# Altium schematic sheet HBridge.SchDoc: Small H Bridge Driver
size A4; Author: Mark Harris; CompanyName: Original Circuit Limited; DrawnBy: Mark Harris; Engineer: Mark Harris; Organization: Original Circuit Limited; DocumentNumber: SHB-001; Revision: 0; SheetNumber: 1; SheetTotal: 1
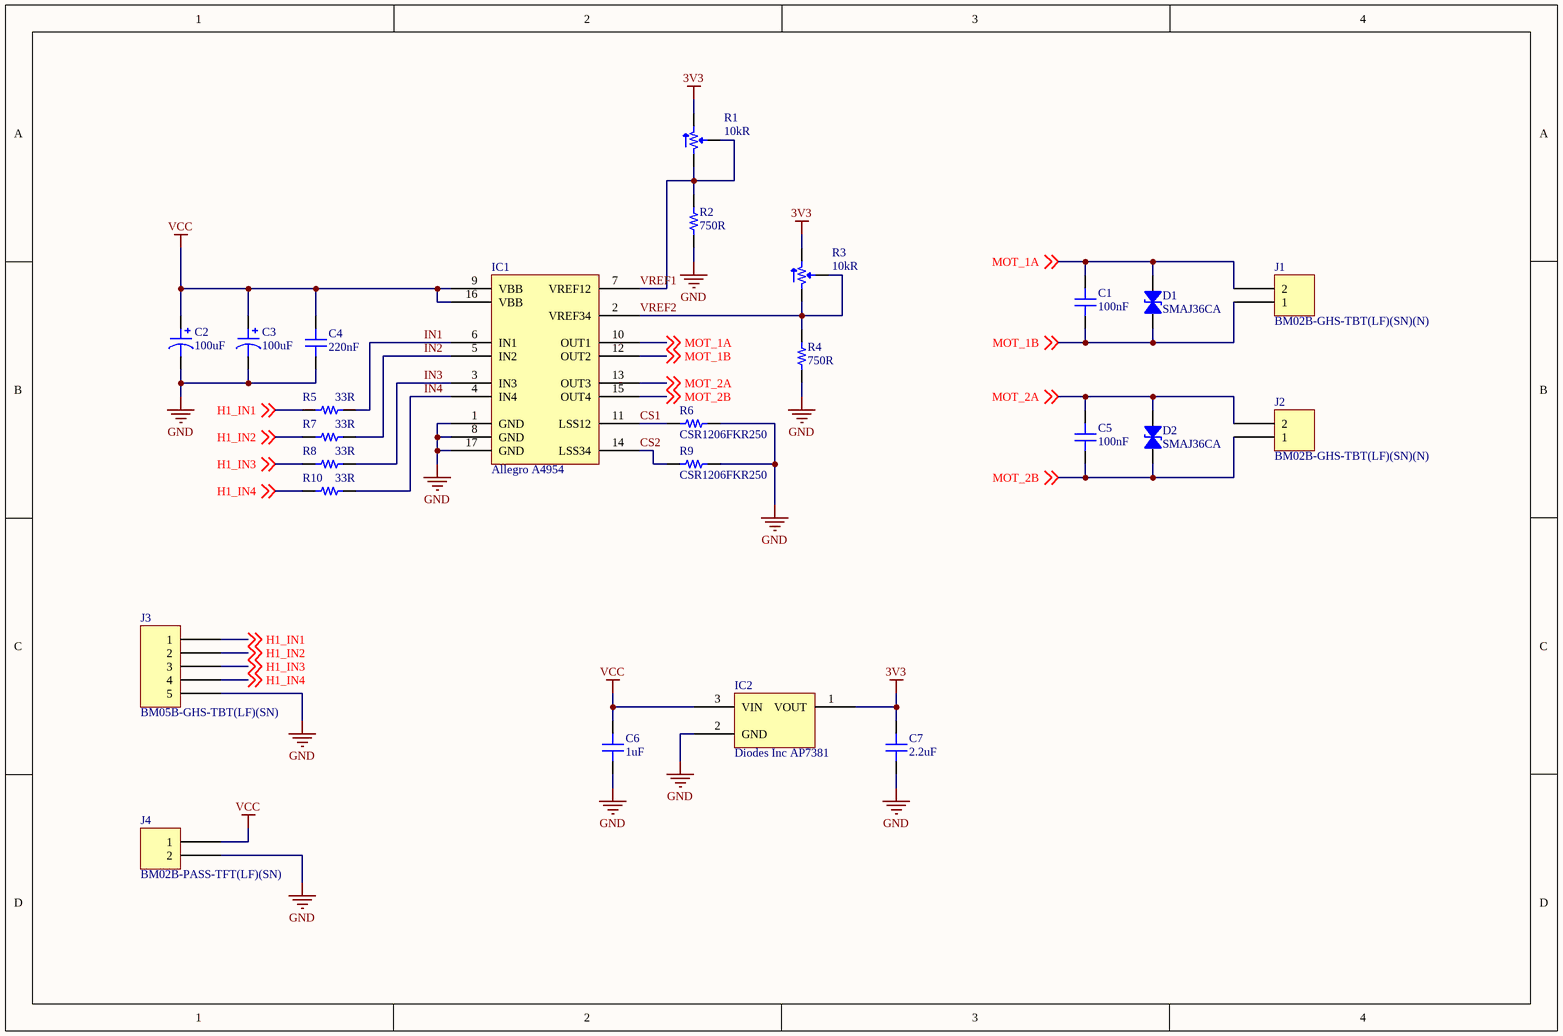
[diagram p0: HBridge.SchDoc]

## Parts
C1  100nF  [CAP 0402/1005]
C2  100uF  [CAP ALUM 8.3MM]
C3  100uF  [CAP ALUM 8.3MM]
C4  220nF  [CAP 0402/1005]
C5  100nF  [CAP 0402/1005]
C6  1uF  [CAP 0603/1608]
C7  2.2uF  [CAP 0603/1608]
D1  SMAJ36CA  [Bourns DO214AC SMA]
D2  SMAJ36CA  [Bourns DO214AC SMA]
IC1  Allegro A4954  [ALLEGRO TSSOP-16EP LP]
IC2  Diodes Inc AP7381  [DIODES INC SOT-89]
J1  BM02B-GHS-TBT(LF)(SN)(N)  [JST BM02B-GHS-TBT]
J2  BM02B-GHS-TBT(LF)(SN)(N)  [JST BM02B-GHS-TBT]
J3  BM05B-GHS-TBT(LF)(SN)  [JST BM05B-GHS-TBT]
J4  BM02B-PASS-TFT(LF)(SN)  [JST BM02B-GHS-TBT]
R1  10kR  [POT BOURNS TRIMPOT TC33X-1]
R2  750R  [RES 0402/1005]
R3  10kR  [POT BOURNS TRIMPOT TC33X-1]
R4  750R  [RES 0402/1005]
R5  33R  [RES 0402/1005]
R6  CSR1206FKR250  [STACKPOLE CSR1210]
R7  33R  [RES 0402/1005]
R8  33R  [RES 0402/1005]
R9  CSR1206FKR250  [STACKPOLE CSR1210]
R10  33R  [RES 0402/1005]

## Nets
3V3: C7.2 IC2.1(VOUT) R1.3 R3.3
GND: C2.2 C3.2 C4.2 C6.1 C7.1 IC1.1(GND) IC1.8(GND) IC1.17(GND) IC2.2(GND) J3.5 J4.2 R2.1 R4.1 R6.2 R9.2
VCC: C2.1 C3.1 C4.1 C6.2 IC1.9(VBB) IC1.16(VBB) IC2.3(VIN) J4.1
CS1: IC1.11(LSS12) R6.1
CS2: IC1.14(LSS34) R9.1
H1_IN1: J3.1 R5.1 ; off-sheet H1_IN1
H1_IN2: J3.2 R7.1 ; off-sheet H1_IN2
H1_IN3: J3.3 R8.1 ; off-sheet H1_IN3
H1_IN4: J3.4 R10.1 ; off-sheet H1_IN4
IN1: IC1.6(IN1) R5.2
IN2: IC1.5(IN2) R7.2
IN3: IC1.3(IN3) R8.2
IN4: IC1.4(IN4) R10.2
MOT_1A: C1.1 D1.2 IC1.10(OUT1) J1.2 ; off-sheet MOT_1A
MOT_1B: C1.2 D1.1 IC1.12(OUT2) J1.1 ; off-sheet MOT_1B
MOT_2A: C5.1 D2.2 IC1.13(OUT3) J2.2 ; off-sheet MOT_2A
MOT_2B: C5.2 D2.1 IC1.15(OUT4) J2.1 ; off-sheet MOT_2B
VREF1: IC1.7(VREF12) R1.1 R1.2 R2.2
VREF2: IC1.2(VREF34) R3.1 R3.2 R4.2

## Notes on the sheet
- Title
- Size:
- Date:
- A4
- Number:
- Time:
- Revision:
- Sheet
- of
- File:

## Library data of the parts
C1 C5 = Capacitor: SMT Capacitor; Manufacturer 1: Samsung; Manufacturer Part Number 1: CL05B104KO5NFNC; Tolerance: 10%; Voltage Rating: 16V; Dielectric: X7R; Supplier 1: Digi-Key; Supplier Part Number 1: 1276-1508-1-ND; Stock 1: 1111422; Pricing 1: 1=0.10000, 10=0.02400, 100=0.01060, 500=0.00760, 1000=0.00597, 2500=0.00542, 5000=0.00499 (USD); RoHS: Yes; Mount: Surface Mount; Case/Package: 0402; Case Code (Metric): 1005; Case Code (Imperial): 0402; Min Operating Temperature: -55°C; Max Operating Temperature: 125°C; Packaging: Tape and Reel; Package Quantity: 1; Capacitance: 100nF; Length: 1mm; Height: 0.5mm; Width: 0.02inch; Thickness: 0.022inch; Depth: 0.5mm; Radiation Hardening: No; ComponentLink1URL: https://datasheet.ciiva.com/25767/cl05b104ko5nfnc-25767124.pdf?src-supplier=Digi-Key; ComponentLink1Description: https://datasheet.ciiva.com/25767/cl05b104ko5nfnc-25767124.pdf?src-supplier=Digi-Key
C2 C3 = Polarised Capacitor: SMT Polarised Capacitor; Manufacturer 1: Nichicon; Manufacturer Part Number 1: UWT1H101MNL1GS; Dielectric Material: Aluminium; Tolerance: 20%; Ripple Current: 140mA; Voltage Rating: 50V; Leakage Current: 3uA; Life (Hours): 1000Hour; Dissipation Factor: 0.14%; Supplier 1: Digi-Key; Supplier Part Number 1: 493-2226-1-ND; Stock 1: 229777; Pricing 1: 1=0.48000, 10=0.34100, 100=0.22440 (USD); RoHS: Yes; Mount: Surface Mount; Case/Package: Radial; Number of Pins: 2; Min Operating Temperature: -55°C; Max Operating Temperature: 105°C; Capacitance: 100uF; Package Quantity: 500; Packaging: Tape and Reel; Ripple Current (AC): 140mA; Voltage Rating (DC): 50V; Termination: SMD/SMT; Voltage: 50V; Diameter: 8mm; Length: 10mm; Height: 10mm; Height - Seated (Max): 0.413inch; Radiation Hardening: No; REACH SVHC: No SVHC; Lead Free: Lead Free; ComponentLink1URL: https://datasheet.ciiva.com/97/e-wt-97104.pdf?src-supplier=Digi-Key; ComponentLink1Description: https://datasheet.ciiva.com/97/e-wt-97104.pdf?src-supplier=Digi-Key; ComponentLink2URL: https://datasheet.ciiva.com/97/e-wt-97105.pdf?src-supplier=Digi-Key; ComponentLink2Description: https://datasheet.ciiva.com/97/e-wt-97105.pdf?src-supplier=Digi-Key; ComponentLink3URL: https://datasheet.ciiva.com/97/e-wt-97106.pdf?src-supplier=Digi-Key; ComponentLink3Description: https://datasheet.ciiva.com/97/e-wt-97106.pdf?src-supplier=Digi-Key; ComponentLink4URL: https://datasheet.ciiva.com/11776/0900766b80fa3a91-11776930.pdf?src-supplier=RSComponents; ComponentLink4Description: https://datasheet.ciiva.com/11776/0900766b80fa3a91-11776930.pdf?src-supplier=RSComponents; ComponentLink5URL: https://datasheet.ciiva.com/5362/e-wt-30307-5362773.pdf?src-supplier=Mouser; ComponentLink5Description: https://datasheet.ciiva.com/5362/e-wt-30307-5362773.pdf?src-supplier=Mouser; ComponentLink6URL: https://datasheet.ciiva.com/11686/e-wt-11686889.pdf?src-supplier=Avnet; ComponentLink6Description: https://datasheet.ciiva.com/11686/e-wt-11686889.pdf?src-supplier=Avnet; ComponentLink7URL: https://datasheet.ciiva.com/28458/1910938-28458459.pdf?src-supplier=Element14; ComponentLink7Description: https://datasheet.ciiva.com/28458/1910938-28458459.pdf?src-supplier=Element14; ComponentLink8URL: https://datasheet.ciiva.com/16502/e-wt-16502940.pdf?src-supplier=Future+Electronics; ComponentLink8Description: https://datasheet.ciiva.com/16502/e-wt-16502940.pdf?src-supplier=Future+Electronics; ComponentLink9URL: https://datasheet.ciiva.com/7781/e-wt-7781807.pdf?src-supplier=Element14; ComponentLink9Description: https://datasheet.ciiva.com/7781/e-wt-7781807.pdf?src-supplier=Element14; ComponentLink10URL: https://datasheet.ciiva.com/17527/e-wt-17527183.pdf?src-supplier=Avnet+Europe; ComponentLink10Description: https://datasheet.ciiva.com/17527/e-wt-17527183.pdf?src-supplier=Avnet+Europe
C4 = Capacitor: SMT Capacitor; Manufacturer 1: Taiyo Yuden; Manufacturer Part Number 1: UMK105BJ224KV-F; Tolerance: 10%; Voltage Rating: 50V; Dielectric: X5R; Supplier 1: Digi-Key; Supplier Part Number 1: 587-3500-1-ND; Stock 1: 571795; Pricing 1: 1=0.21000, 10=0.14000, 100=0.07110, 500=0.04868, 1000=0.04306, 2500=0.04119, 5000=0.03744 (USD); RoHS: Yes; Mount: Surface Mount; Case/Package: 0402; Case Code (Metric): 1005; Case Code (Imperial): 0402; Min Operating Temperature: -55°C; Max Operating Temperature: 85°C; Package Quantity: 10000; Packaging: Tape and Reel; Capacitance: 220nF; Voltage Rating (DC): 50V; Termination: SMD/SMT; Length: 0.039inch; Height: 0.5mm; Width: 0.02inch; Thickness: 0.022inch; Lead Free: Lead Free; Halogen Free: Halogen Free; ComponentLink1URL: https://datasheet.ciiva.com/24495/460umk105bj224kv-f-24495779.pdf?src-supplier=Onlinecomponents.com; ComponentLink1Description: https://datasheet.ciiva.com/24495/460umk105bj224kv-f-24495779.pdf?src-supplier=Onlinecomponents.com; ComponentLink2URL: https://datasheet.ciiva.com/30112/713umk105bj224kv-f-30112478.pdf?src-supplier=Onlinecomponents.com; ComponentLink2Description: https://datasheet.ciiva.com/30112/713umk105bj224kv-f-30112478.pdf?src-supplier=Onlinecomponents.com; ComponentLink3URL: https://datasheet.ciiva.com/18697/mlcc-all-e-18697509.pdf?src-supplier=Digi-Key; ComponentLink3Description: https://datasheet.ciiva.com/18697/mlcc-all-e-18697509.pdf?src-supplier=Digi-Key
C6 = Capacitor: SMT Capacitor; Manufacturer 1: Samsung; Manufacturer Part Number 1: CL10A105KB8NNNC; Tolerance: 10%; Voltage Rating: 50V; Dielectric: X5R; Supplier 1: Digi-Key; Supplier Part Number 1: 1276-1860-1-ND; Stock 1: 1648884; Pricing 1: 1=0.17000, 10=0.12100, 100=0.05680, 500=0.03982, 1000=0.03297 (USD); RoHS: Yes; Mount: Surface Mount; Case/Package: 0603; Case Code (Metric): 1608; Case Code (Imperial): 0603; Contact Plating: Tin; Min Operating Temperature: -55°C; Max Operating Temperature: 85°C; Package Quantity: 1; Packaging: Tape and Reel; Capacitance: 1uF; Termination: Wraparound; Length: 1.6mm; Width: 0.031inch; Thickness: 0.035inch; Depth: 0.8mm; Radiation Hardening: No; ComponentLink1URL: https://datasheet.ciiva.com/26877/getdatasheetpartid-753736-26877879.pdf?src-supplier=Verical; ComponentLink1Description: https://datasheet.ciiva.com/26877/getdatasheetpartid-753736-26877879.pdf?src-supplier=Verical
C7 = Capacitor: SMT Capacitor; Manufacturer 1: Samsung; Manufacturer Part Number 1: CL10A225KP8NNNC; Material: Ceramic; Tolerance: 10%; Dielectric: X5R; Voltage Rating: 10V; Supplier 1: Digi-Key; Supplier Part Number 1: 1276-1085-1-ND; Stock 1: 239176; Pricing 1: 1=0.10000, 10=0.07600, 100=0.03400, 500=0.02426, 1000=0.01906 (USD); RoHS: Yes; Mount: Surface Mount; Case/Package: 0603; Case Code (Metric): 1608; Case Code (Imperial): 0603; Min Operating Temperature: -55°C; Max Operating Temperature: 85°C; Capacitance: 2.2uF; Package Quantity: 1; Packaging: Tape and Reel; Voltage: 10V; Voltage Rating (DC): 10V; Length: 1.6mm; Height: 0.8mm; Width: 0.031inch; Thickness: 0.035inch; Depth: 0.8mm; Radiation Hardening: No; Lead Free: Lead Free; ComponentLink1URL: https://datasheet.ciiva.com/25799/cl10a225kp8nnnc-25799697.pdf?src-supplier=Digi-Key; ComponentLink1Description: https://datasheet.ciiva.com/25799/cl10a225kp8nnnc-25799697.pdf?src-supplier=Digi-Key; ComponentLink2URL: https://datasheet.ciiva.com/26838/getdatasheetpartid-358617-26838359.pdf?src-supplier=Verical; ComponentLink2Description: https://datasheet.ciiva.com/26838/getdatasheetpartid-358617-26838359.pdf?src-supplier=Verical; ComponentLink3URL: https://datasheet.ciiva.com/29198/457945-da-01-en-vs-kondensator-0603-29198592.pdf?src-supplier=Conrad; ComponentLink3Description: https://datasheet.ciiva.com/29198/457945-da-01-en-vs-kondensator-0603-29198592.pdf?src-supplier=Conrad
D1 D2 = Diode Zener Bidirectional: Bidirectional Zener Diode; Manufacturer 1: Bourns; Operating Supply Voltage: 3.5V; Max Surge Current: 40A; Number of Elements: 1; Reverse Breakdown Voltage: 40V; Reverse Standoff Voltage: 36V; Clamping Voltage: 58.1V; Peak Pulse Power: 400W; Power Line Protection: No; Breakdown Voltage: 44.2V; Max Reverse Leakage Current: 5uA; Test Current: 1mA; ESD Protection: Yes; Peak Pulse Current: 6.9A; Element Configuration: Single; Supplier 1: Digi-Key; Supplier Part Number 1: SMAJ36CABCT-ND; Manufacturer Part Number 1: SMAJ36CA; Stock 1: 7267; Pricing 1: 1=0.47000, 10=0.35100, 25=0.31600, 100=0.21840, 250=0.18392, 500=0.14944, 1000=0.11496, 2500=0.10346 (USD); RoHS: Yes; Mount: Surface Mount; Case/Package: SMA; Number of Pins: 2; Min Operating Temperature: -55°C; Max Operating Temperature: 150°C; Package Quantity: 1; Direction: Bidirectional; Packaging: Tape and Reel; Number of Bidirectional Channels: 1; Min Breakdown Voltage: 40V; Number of Channels: 1; Polarity: Bidirectional; Termination: SMD/SMT; Max Breakdown Voltage: 44.2V; Max Power Dissipation: 400W; Leakage Current: 5uA; Composition: Zener; Length: 4.57mm; Height: 2.42mm; Width: 2.92mm; Radiation Hardening: No; REACH SVHC: No SVHC; ComponentLink1URL: https://datasheet.ciiva.com/25624/0900766b8112213b-25624856.pdf?src-supplier=RSComponents; ComponentLink1Description: https://datasheet.ciiva.com/25624/0900766b8112213b-25624856.pdf?src-supplier=RSComponents; ComponentLink2URL: https://datasheet.ciiva.com/17413/smaj-17413531.pdf?src-supplier=Avnet+Europe; ComponentLink2Description: https://datasheet.ciiva.com/17413/smaj-17413531.pdf?src-supplier=Avnet+Europe; ComponentLink3URL: https://datasheet.ciiva.com/8031/1695388-8031055.pdf?src-supplier=Element14; ComponentLink3Description: https://datasheet.ciiva.com/8031/1695388-8031055.pdf?src-supplier=Element14; ComponentLink4URL: https://datasheet.ciiva.com/334/smaj-334464.pdf?src-supplier=Digi-Key; ComponentLink4Description: https://datasheet.ciiva.com/334/smaj-334464.pdf?src-supplier=Digi-Key; ComponentLink5URL: https://datasheet.ciiva.com/3021/smaj-3021395.pdf?src-supplier=Avnet; ComponentLink5Description: https://datasheet.ciiva.com/3021/smaj-3021395.pdf?src-supplier=Avnet; ComponentLink6URL: https://datasheet.ciiva.com/3022/smaj-3022260.pdf?src-supplier=Avnet; ComponentLink6Description: https://datasheet.ciiva.com/3022/smaj-3022260.pdf?src-supplier=Avnet; ComponentLink7URL: https://datasheet.ciiva.com/8031/smaj-8031146.pdf?src-supplier=Element14; ComponentLink7Description: https://datasheet.ciiva.com/8031/smaj-8031146.pdf?src-supplier=Element14; ComponentLink8URL: https://datasheet.ciiva.com/8031/smaj-8031147.pdf?src-supplier=Element14; ComponentLink8Description: https://datasheet.ciiva.com/8031/smaj-8031147.pdf?src-supplier=Element14; ComponentLink9URL: https://datasheet.ciiva.com/334/smaj-334462.pdf?src-supplier=Digi-Key; ComponentLink9Description: https://datasheet.ciiva.com/334/smaj-334462.pdf?src-supplier=Digi-Key; ComponentLink10URL: https://datasheet.ciiva.com/334/smaj-334463.pdf?src-supplier=Digi-Key; ComponentLink10Description: https://datasheet.ciiva.com/334/smaj-334463.pdf?src-supplier=Digi-Key; ComponentLink11URL: https://datasheet.ciiva.com/16237/smaj-16237407.pdf?src-supplier=Onlinecomponents.com; ComponentLink11Description: https://datasheet.ciiva.com/16237/smaj-16237407.pdf?src-supplier=Onlinecomponents.com
IC1 = Allegro A4954: Manufacturer 1: Allegro MicroSystems; Manufacturer Part Number 1: A4954ELPTR-T; Min Supply Voltage: 8V; Max Supply Voltage: 40V; Number of Outputs: 2; Output Current: 1.5A; Supplier 1: Digi-Key; Supplier Part Number 1: 620-1384-1-ND; Stock 1: 59866; Pricing 1: 1=2.84000, 10=2.54900, 25=2.41040, 100=2.08880, 250=1.98172, 500=1.77820, 1000=1.49968 (USD); RoHS: Yes; Mount: Surface Mount; Case/Package: TSSOP; Min Operating Temperature: -40°C; Max Operating Temperature: 85°C; Packaging: Tape and Reel; Package Quantity: 1; Lead Free: Lead Free; ComponentLink1URL: https://datasheet.ciiva.com/8199/a4954-datasheet-8199653.pdf?src-supplier=Avnet; ComponentLink1Description: https://datasheet.ciiva.com/8199/a4954-datasheet-8199653.pdf?src-supplier=Avnet; ComponentLink2URL: https://datasheet.ciiva.com/17233/a4954-datasheet-17233770.pdf?src-supplier=Avnet+Europe; ComponentLink2Description: https://datasheet.ciiva.com/17233/a4954-datasheet-17233770.pdf?src-supplier=Avnet+Europe
IC2 = Diodes Inc AP7381: 150mA Low quiescent current fast transient low drop out linear regulator; Manufacturer Part Number 1: AP7381-33Y-13; Supplier 1: Digi-Key; Supplier Part Number 1: AP7381-33Y-13DICT-ND; Manufacturer 1: Diodes; Stock 1: 11928; Pricing 1: 1=0.44000, 10=0.32900, 100=0.20480, 500=0.14014, 1000=0.10780 (USD); RoHS: No; ComponentLink1URL: https://www.diodes.com/assets/Datasheets/AP7381.pdf?src-supplier=Digi-Key; ComponentLink1Description: https://www.diodes.com/assets/Datasheets/AP7381.pdf?src-supplier=Digi-Key
J1 J2 = 2 Pin: Manufacturer 1: JST; Number of Positions: 2; Connector Type: Outer Shroud Contact; Pitch: 0.049inch; Supplier 1: Digi-Key; Supplier Part Number 1: 455-1578-1-ND; Manufacturer Part Number 1: BM02B-GHS-TBT(LF)(SN)(N); Stock 1: 70745; Pricing 1: 1=0.43000, 10=0.40500, 100=0.28330, 500=0.24284, 1000=0.20236 (USD); RoHS: Yes; Mount: Surface Mount; Contact Plating: Tin; Color: Natural; Packaging: Tape and Reel; Number of Rows: 1; Termination: Solder; Fastening Type: Ramp; Lead Free: Lead Free; ComponentLink1URL: http://www.jst-mfg.com/product/pdf/eng/eGH.pdf?src-supplier=Digi-Key; ComponentLink1Description: http://www.jst-mfg.com/product/pdf/eng/eGH.pdf?src-supplier=Digi-Key
J3 = 5 Pin: Manufacturer 1: JST; Number of Positions: 5; Current Rating: 1A; Voltage Rating: 50V; Pitch: 1.25mm; Connector Type: Outer Shroud Contact; Supplier 1: RSComponents; Supplier Part Number 1: 7521778; Manufacturer Part Number 1: BM05B-GHS-TBT(LF)(SN); Stock 1: 460; Pricing 1: 5=0.45000, 125=0.32200, 500=0.28800, 2500=0.26800, 5000=0.25400 (GBP); RoHS: Yes; Case/Package: SMD/SMT; Contact Plating: Tin; Contact Material: Bronze; Housing Color: Natural; Housing Material: Nylon; Number of Rows: 1; Termination: Solder; Packaging: Cut Tape; Number of Contacts: 5; Orientation: Straight; Lead Free: Lead Free; REACH SVHC: No SVHC; ComponentLink1URL: https://datasheet.ciiva.com/25617/0900766b810cef17-25617254.pdf?src-supplier=RSComponents; ComponentLink1Description: https://datasheet.ciiva.com/25617/0900766b810cef17-25617254.pdf?src-supplier=RSComponents; ComponentLink2URL: https://datasheet.ciiva.com/16419/egh-16419225.pdf?src-supplier=Future+Electronics; ComponentLink2Description: https://datasheet.ciiva.com/16419/egh-16419225.pdf?src-supplier=Future+Electronics; Supplier 2: Digi-Key; Supplier Part Number 2: 455-1581-1-ND; Manufacturer 2: JST; Manufacturer Part Number 2: BM05B-GHS-TBT(LF)(SN)(N); Stock 2: 19737; Pricing 2: 1=0.46000, 10=0.43200, 100=0.33110, 500=0.28792, 1000=0.23753 (USD); Mount: Surface Mount; Number of Pins: 5; Color: Natural; Fastening Type: Ramp; ComponentLink3URL: http://www.jst-mfg.com/product/pdf/eng/eGH.pdf?src-supplier=Digi-Key; ComponentLink3Description: http://www.jst-mfg.com/product/pdf/eng/eGH.pdf?src-supplier=Digi-Key; ComponentLink4URL: http://www.jst-mfg.com/product/pdf/eng/eGH.pdf?src-supplier=Arrow; ComponentLink4Description: http://www.jst-mfg.com/product/pdf/eng/eGH.pdf?src-supplier=Arrow; ComponentLink5URL: http://www.jst-mfg.com/product/pdf/eng/eGH.pdf?src-supplier=Verical; ComponentLink5Description: http://www.jst-mfg.com/product/pdf/eng/eGH.pdf?src-supplier=Verical
J4 = 2 Pin: Manufacturer 1: JST; Number of Positions: 2; Gender: Male; Pitch: 2mm; Supplier 1: Future Electronics; Supplier Part Number 1: BM02B-PASS-TFT(LF)(SN)-CUTT; Manufacturer Part Number 1: BM02B-PASS-TFT(LF)(SN); Stock 1: 290894; Pricing 1: 1=0.90000, 25=0.70000, 50=0.66500, 100=0.63000, 250=0.58500 (USD); RoHS: Yes; Case/Package: SMD/SMT; Color: Beige; Contact Material: Copper; Termination: Crimp; Lead Free: Lead Free; ComponentLink1URL: http://www1.futureelectronics.com/doc/JST/BM02B-PASS-TFT(LF)(SN).pdf?src-supplier=Future+Electronics; ComponentLink1Description: http://www1.futureelectronics.com/doc/JST/BM02B-PASS-TFT(LF)(SN).pdf?src-supplier=Future+Electronics; ComponentLink2URL: http://www.jst-mfg.com/product/pdf/eng/ePA-F.pdf?src-supplier=Digi-Key; ComponentLink2Description: http://www.jst-mfg.com/product/pdf/eng/ePA-F.pdf?src-supplier=Digi-Key
R1 R3 = Potentiometer: Manufacturer 1: Bourns; Manufacturer Part Number 1: TC33X-1-103E; Tolerance: 25%; Power Rating: 100mW; Temperature Coefficient: 250ppm/°C; Supplier 1: Digi-Key; Supplier Part Number 1: TC33X-1-103ECT-ND; Stock 1: 60149; Pricing 1: 1=0.28000, 10=0.27700, 25=0.25040, 50=0.23880, 100=0.23100, 250=0.21560, 500=0.19636, 1000=0.17710 (USD); RoHS: Yes; Mount: Surface Mount; Min Operating Temperature: -40°C; Max Operating Temperature: 100°C; Resistance: 10kR; Package Quantity: 2500; Packaging: Tape and Reel; Termination: Foot Print; Military Standard: Not; Max Power Dissipation: 100mW; Composition: Cermet; Length: 3mm; Height: 0.047inch; Width: 0.118inch; Depth: 3.8mm; ComponentLink1URL: https://datasheet.ciiva.com/17562/tc33-17562453.pdf?src-supplier=Avnet+Europe; ComponentLink1Description: https://datasheet.ciiva.com/17562/tc33-17562453.pdf?src-supplier=Avnet+Europe; ComponentLink2URL: https://datasheet.ciiva.com/2159/tc33-2159804.pdf?src-supplier=Digi-Key; ComponentLink2Description: https://datasheet.ciiva.com/2159/tc33-2159804.pdf?src-supplier=Digi-Key
R2 R4 = Resistor: SMT Resistor; Manufacturer 1: Panasonic; Manufacturer Part Number 1: ERJ2RKF7500X; Power Rating: 100mW; Tolerance: 1%; Voltage Rating: 50V; Temperature Coefficient: 100ppm/°C; Supplier 1: Newark; Supplier Part Number 1: 63W0663; Stock 1: 0; RoHS: Yes; Mount: Surface Mount; Case/Package: 0402; Case Code (Metric): 1005; Case Code (Imperial): 0402; Contact Plating: Tin; Min Operating Temperature: -55°C; Max Operating Temperature: 155°C; Resistance: 750R; Packaging: Tape and Reel; Composition: Thick Film; Military Standard: Not; Voltage Rating (DC): 50V; Package Quantity: 10000; Number of Terminations: 2; Termination: SMD/SMT; Max Power Dissipation: 100mW; Features: Automotive AEC-Q200; Length: 1mm; Height: 0.35mm; Depth: 0.5mm; Width: 0.02inch; REACH SVHC: No SVHC; Lead Free: Lead Free; ComponentLink1URL: https://datasheet.ciiva.com/9180/aoa0000ce2-9180085.pdf?src-supplier=Avnet; ComponentLink1Description: https://datasheet.ciiva.com/9180/aoa0000ce2-9180085.pdf?src-supplier=Avnet; ComponentLink2URL: https://datasheet.ciiva.com/28676/1678782-28676646.pdf?src-supplier=Element14; ComponentLink2Description: https://datasheet.ciiva.com/28676/1678782-28676646.pdf?src-supplier=Element14; ComponentLink3URL: https://datasheet.ciiva.com/28565/1678782-28565079.pdf?src-supplier=Element14; ComponentLink3Description: https://datasheet.ciiva.com/28565/1678782-28565079.pdf?src-supplier=Element14; ComponentLink4URL: https://datasheet.ciiva.com/30202/aoa0000ce2-30202551.pdf?src-supplier=Onlinecomponents.com; ComponentLink4Description: https://datasheet.ciiva.com/30202/aoa0000ce2-30202551.pdf?src-supplier=Onlinecomponents.com
R5 R7 R8 R10 = Resistor: SMT Resistor; Manufacturer 1: Panasonic; Manufacturer Part Number 1: ERJ-2GEJ330X; Tolerance: 5%; Power Rating: 100mW; Voltage Rating: 50V; Temperature Coefficient: 200ppm/°C; Supplier 1: Digi-Key; Supplier Part Number 1: P33JCT-ND; Stock 1: 2284531; Pricing 1: 1=0.10000, 10=0.03100, 100=0.01250, 1000=0.00560, 2500=0.00486, 5000=0.00401 (USD); RoHS: Yes; Mount: Surface Mount; Case/Package: 0402; Case Code (Metric): 1005; Case Code (Imperial): 0402; Contact Plating: Tin; Min Operating Temperature: -55°C; Max Operating Temperature: 155°C; Resistance: 33R; Packaging: Tape and Reel; Composition: Thick Film; Package Quantity: 1; Number of Terminations: 2; Termination: SMD/SMT; Military Standard: Not; Max Power Dissipation: 100mW; Voltage Rating (DC): 50V; Features: Automotive AEC-Q200; Length: 1mm; Height: 0.35mm; Depth: 0.5mm; Width: 0.02inch; Radiation Hardening: No; REACH SVHC: No SVHC; Lead Free: Lead Free; ComponentLink1URL: https://datasheet.ciiva.com/11821/0900766b80f806dd-11821291.pdf?src-supplier=RSComponents; ComponentLink1Description: https://datasheet.ciiva.com/11821/0900766b80f806dd-11821291.pdf?src-supplier=RSComponents; ComponentLink2URL: https://datasheet.ciiva.com/39121/1986916-39121637.pdf?src-supplier=Jameco; ComponentLink2Description: https://datasheet.ciiva.com/39121/1986916-39121637.pdf?src-supplier=Jameco; ComponentLink3URL: https://datasheet.ciiva.com/43460/1500035-43460357.pdf?src-supplier=Farnell; ComponentLink3Description: https://datasheet.ciiva.com/43460/1500035-43460357.pdf?src-supplier=Farnell; ComponentLink4URL: https://datasheet.ciiva.com/46374/1500035-46374021.pdf?src-supplier=Element14; ComponentLink4Description: https://datasheet.ciiva.com/46374/1500035-46374021.pdf?src-supplier=Element14; ComponentLink5URL: https://datasheet.ciiva.com/16522/aoa0000ce1-16522983.pdf?src-supplier=Avnet+Asia; ComponentLink5Description: https://datasheet.ciiva.com/16522/aoa0000ce1-16522983.pdf?src-supplier=Avnet+Asia; ComponentLink6URL: https://datasheet.ciiva.com/9190/aoa0000ce1-9190504.pdf?src-supplier=Avnet; ComponentLink6Description: https://datasheet.ciiva.com/9190/aoa0000ce1-9190504.pdf?src-supplier=Avnet; ComponentLink7URL: https://datasheet.ciiva.com/16449/aoa0000ce1-16449547.pdf?src-supplier=Future+Electronics; ComponentLink7Description: https://datasheet.ciiva.com/16449/aoa0000ce1-16449547.pdf?src-supplier=Future+Electronics; ComponentLink8URL: https://datasheet.ciiva.com/28547/1678796-28547165.pdf?src-supplier=Element14; ComponentLink8Description: https://datasheet.ciiva.com/28547/1678796-28547165.pdf?src-supplier=Element14; ComponentLink9URL: https://datasheet.ciiva.com/28686/1678796-28686909.pdf?src-supplier=Element14; ComponentLink9Description: https://datasheet.ciiva.com/28686/1678796-28686909.pdf?src-supplier=Element14; ComponentLink10URL: https://datasheet.ciiva.com/48530/aoa0000ce1-48530957.pdf?src-supplier=Avnet; ComponentLink10Description: https://datasheet.ciiva.com/48530/aoa0000ce1-48530957.pdf?src-supplier=Avnet; ComponentLink11URL: https://datasheet.ciiva.com/16784/70260739-16784442.pdf?src-supplier=Allied+Electronics; ComponentLink11Description: https://datasheet.ciiva.com/16784/70260739-16784442.pdf?src-supplier=Allied+Electronics; ComponentLink12URL: https://datasheet.ciiva.com/30205/4aoa0000ce1-30205131.pdf?src-supplier=Onlinecomponents.com; ComponentLink12Description: https://datasheet.ciiva.com/30205/4aoa0000ce1-30205131.pdf?src-supplier=Onlinecomponents.com; ComponentLink13URL: https://datasheet.ciiva.com/46386/1500035-46386748.pdf?src-supplier=Element14; ComponentLink13Description: https://datasheet.ciiva.com/46386/1500035-46386748.pdf?src-supplier=Element14; ComponentLink14URL: https://datasheet.ciiva.com/5917/1500035-5917807.pdf?src-supplier=Farnell; ComponentLink14Description: https://datasheet.ciiva.com/5917/1500035-5917807.pdf?src-supplier=Farnell
R6 R9 = Resistor: SMT Resistor; Manufacturer 1: Stackpole Electronics; Resistance: 250mR; Tolerance: 1%; Power Rating: 500mW; Temperature Coefficient: 100ppm/°C; Supplier 1: Digi-Key; Supplier Part Number 1: CSR1206FKR250CT-ND; Manufacturer Part Number 1: CSR1206FKR250; Stock 1: 6419; Pricing 1: 1=0.47000, 10=0.35900, 25=0.27280, 50=0.20280, 100=0.15070, 250=0.12732, 500=0.10914 (USD); RoHS: Yes; Mount: Surface Mount; Case/Package: 1206; Case Code (Metric): 3216; Case Code (Imperial): 1206; Contact Plating: Tin,Matte; Min Operating Temperature: -55°C; Max Operating Temperature: 155°C; Packaging: Tape and Reel; Composition: Thick Film; Number of Terminations: 2; Max Power Dissipation: 500mW; Termination: Wraparound; Length: 0.12inch; Height: 0.026inch; Width: 0.061inch; Lead Free: Lead Free; ComponentLink1URL: https://www.seielect.com/catalog/SEI-Packaging.pdf?src-supplier=Digi-Key; ComponentLink1Description: https://www.seielect.com/catalog/SEI-Packaging.pdf?src-supplier=Digi-Key; ComponentLink2URL: https://www.seielect.com/catalog/SEI-CSR_CSRN.pdf?src-supplier=Avnet+Asia; ComponentLink2Description: https://www.seielect.com/catalog/SEI-CSR_CSRN.pdf?src-supplier=Avnet+Asia